# Altium schematic sheet STM32F429.SchDoc
size A3
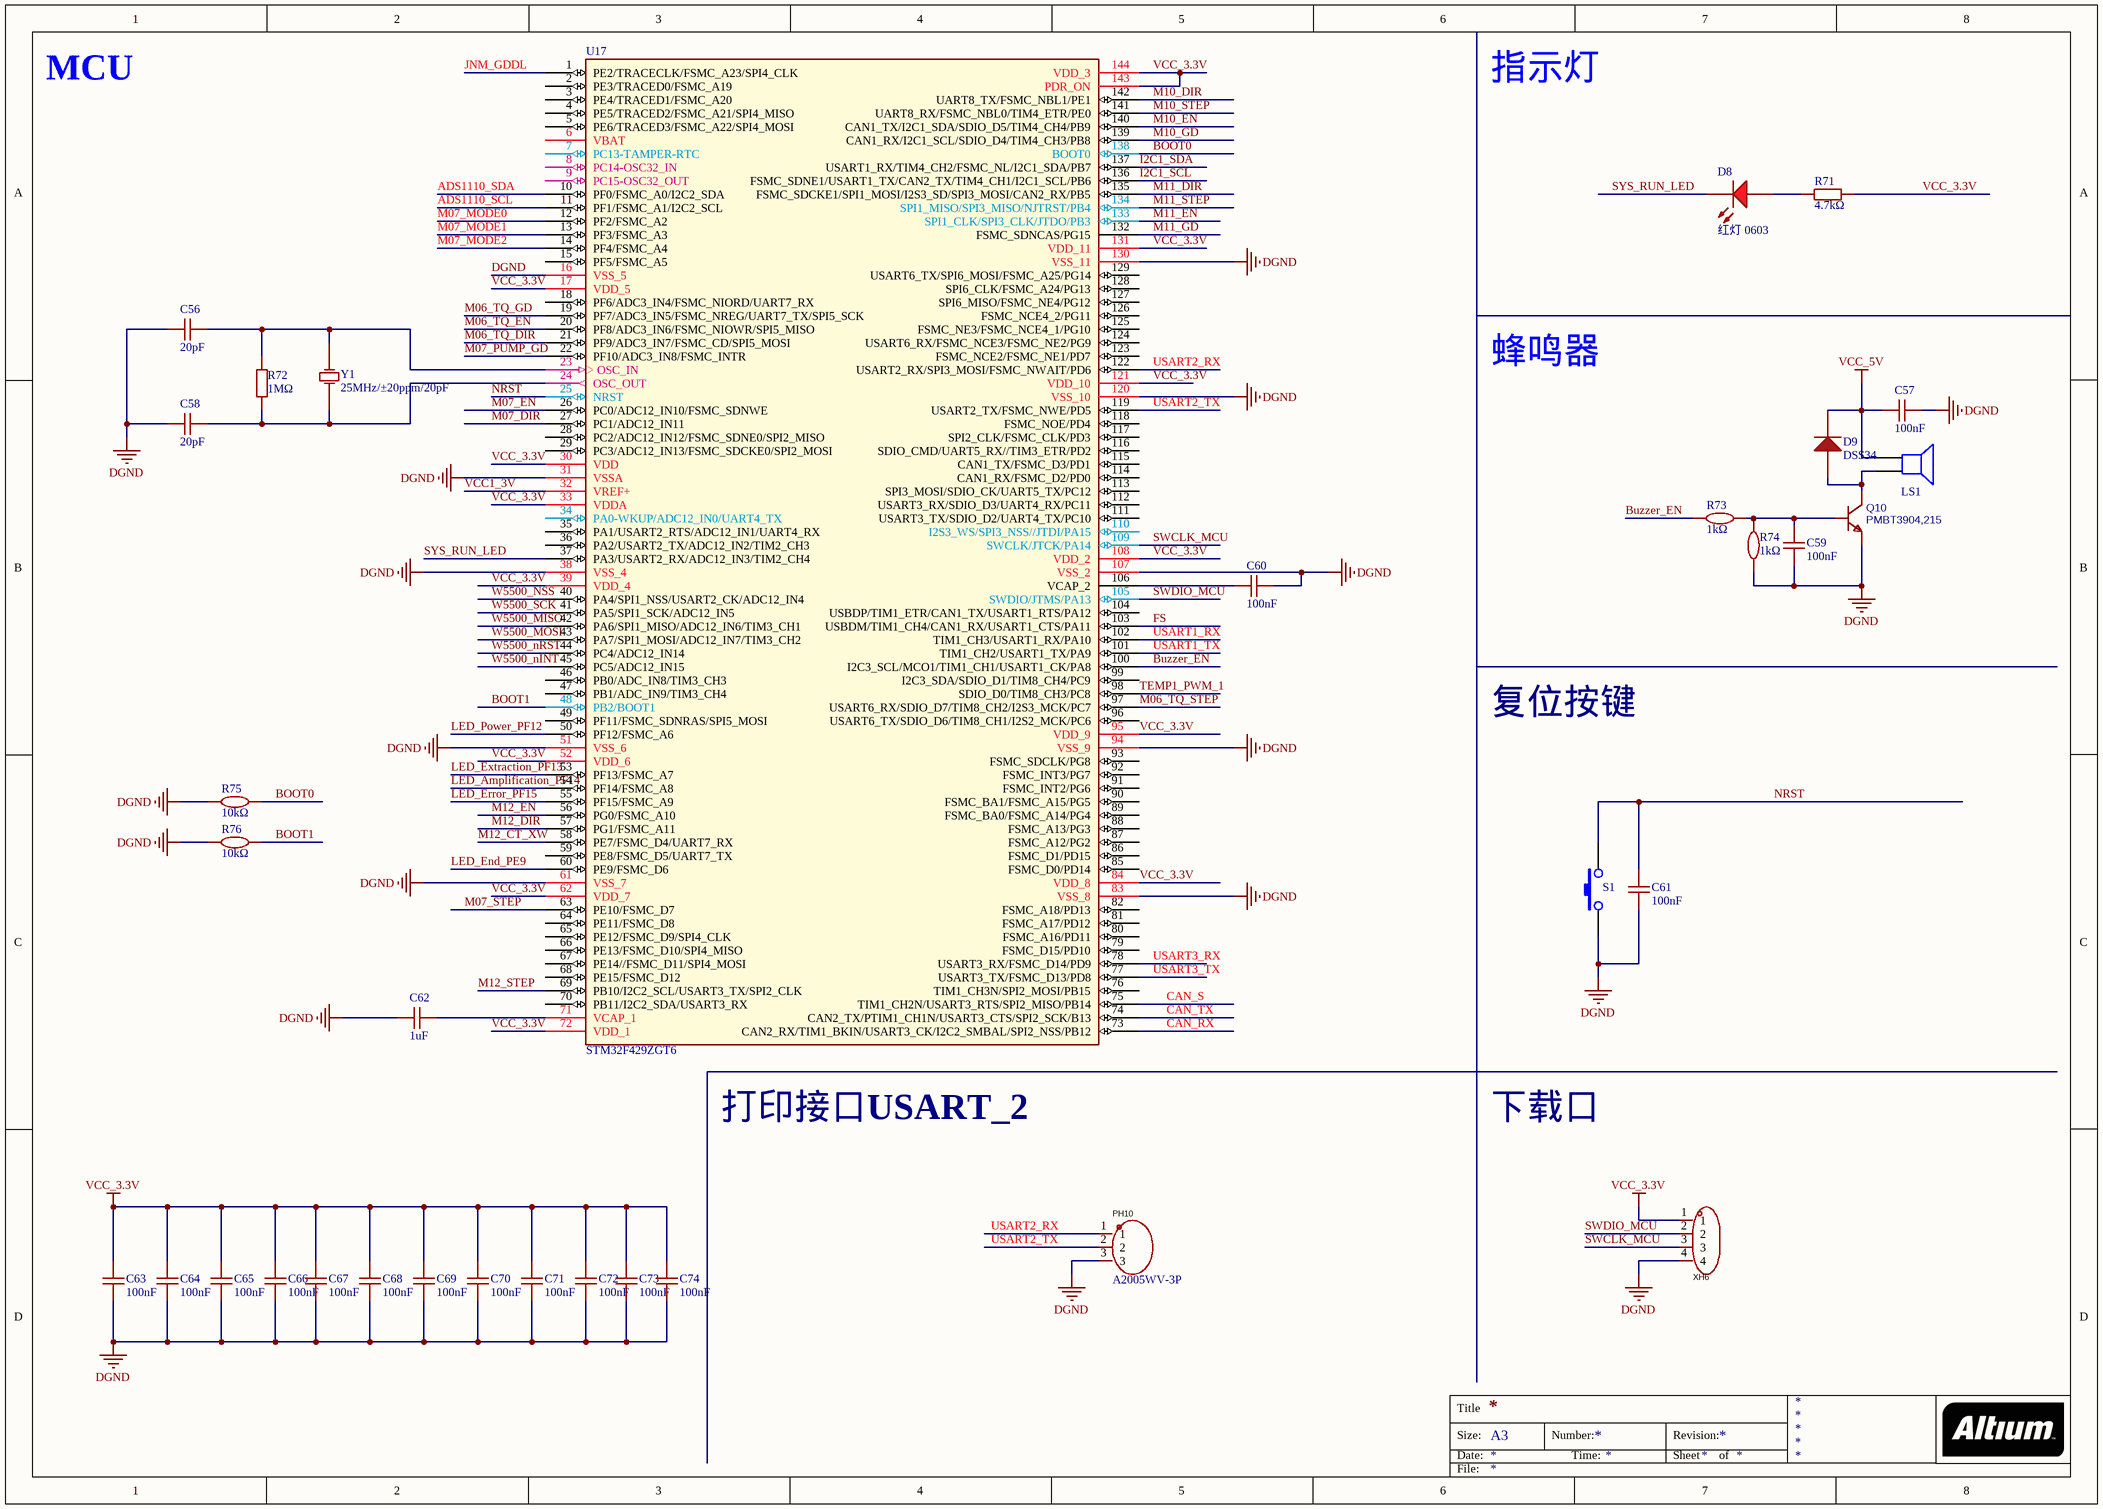
[diagram p0: STM32F429.SchDoc]

## Parts
C56  20pF  [C0603]
C57  100nF  [C0603]
C58  20pF  [C0603]
C59  100nF  [C0603]
C60  100nF  [C0402]
C61  100nF  [C0402]
C62  1uF  [C0402]
C63  100nF  [C0402]
C64  100nF  [C0402]
C65  100nF  [C0402]
C66  100nF  [C0402]
C67  100nF  [C0402]
C68  100nF  [C0402]
C69  100nF  [C0402]
C70  100nF  [C0402]
C71  100nF  [C0402]
C72  100nF  [C0402]
C73  100nF  [C0402]
C74  100nF  [C0402]
D8  红灯 0603  [LED_0603]
D9  DSS34  [SOD-123]
LS1  (no value)  [BUZZER]
PH10  A2005WV-3P  [HDR-TH_3P-P2.00-V-M]
Q10  PMBT3904,215  [SOT-23(SOT-23-3)]
R71  4.7kΩ  [R0603]
R72  1MΩ  [R0603]
R73  1kΩ  [R0603]
R74  1kΩ  [R0603]
R75  10kΩ  [R0402]
R76  10kΩ  [R0402]
S1  (no value)  [SW-S2 贴片]
U17  STM32F429ZGT6  [LQFP-144_20x20x05P]
XH6  A2541WV-4P  [HDR-TH_4P-P2.54-V-M]  (value not drawn)
Y1  25MHz/±20ppm/20pF  [SMD-5032_2P]

## Nets
DGND: C56.1 C57.2 C58.1 C59.1 C60.2 C61.1 C62.1 C63.1 C64.1 C65.1 C66.1 C67.1 C68.1 C69.1 C70.1 C71.1 C72.1 C73.1 C74.1 PH10.3 Q10.2 R74.2 R75.2 R76.2 S1.1 U17.16(VSS_5) U17.31(VSSA) U17.38(VSS_4) U17.51(VSS_6) U17.61(VSS_7) U17.83(VSS_8) U17.94(VSS_9) U17.107(VSS_2) U17.120(VSS_10) U17.130(VSS_11) XH6.4
VCC_3.3V: C63.2 C64.2 C65.2 C66.2 C67.2 C68.2 C69.2 C70.2 C71.2 C72.2 C73.2 C74.2 R71.2 U17.17(VDD_5) U17.30(VDD) U17.33(VDDA) U17.39(VDD_4) U17.52(VDD_6) U17.62(VDD_7) U17.72(VDD_1) U17.84(VDD_8) U17.95(VDD_9) U17.108(VDD_2) U17.121(VDD_10) U17.131(VDD_11) U17.143(PDR_ON) U17.144(VDD_3) XH6.1
VCC_5V: C57.1 D9.2(K) LS1.1
ADS1110_SCL: U17.11(PF1/FSMC_A1/I2C2_SCL)
ADS1110_SDA: U17.10(PF0/FSMC_A0/I2C2_SDA)
BOOT0: R75.1 U17.138(BOOT0)
BOOT1: R76.1 U17.48(PB2/BOOT1)
Buzzer_EN: R73.2 U17.100(I2C3_SCL/MCO1/TIM1_CH1/USART1_CK/PA8)
CAN_RX: U17.73(CAN2_RX/TIM1_BKIN/USART3_CK/I2C2_SMBAL/SPI2_NSS/PB12)
CAN_S: U17.75(TIM1_CH2N/USART3_RTS/SPI2_MISO/PB14)
CAN_TX: U17.74(CAN2_TX/PTIM1_CH1N/USART3_CTS/SPI2_SCK/B13)
FS: U17.103(USBDM/TIM1_CH4/CAN1_RX/USART1_CTS/PA11)
I2C1_SCL: U17.136(FSMC_SDNE1/USART1_TX/CAN2_TX/TIM4_CH1/I2C1_SCL/PB6)
I2C1_SDA: U17.137(USART1_RX/TIM4_CH2/FSMC_NL/I2C1_SDA/PB7)
JNM_GDDL: U17.1(PE2/TRACECLK/FSMC_A23/SPI4_CLK)
LED_Amplification_PF14: U17.54(PF14/FSMC_A8)
LED_End_PE9: U17.60(PE9/FSMC_D6)
LED_Error_PF15: U17.55(PF15/FSMC_A9)
LED_Extraction_PF13: U17.53(PF13/FSMC_A7)
LED_Power_PF12: U17.50(PF12/FSMC_A6)
M06_TQ_DIR: U17.21(PF9/ADC3_IN7/FSMC_CD/SPI5_MOSI)
M06_TQ_EN: U17.20(PF8/ADC3_IN6/FSMC_NIOWR/SPI5_MISO)
M06_TQ_GD: U17.19(PF7/ADC3_IN5/FSMC_NREG/UART7_TX/SPI5_SCK)
M06_TQ_STEP: U17.97(USART6_RX/SDIO_D7/TIM8_CH2/I2S3_MCK/PC7)
M07_DIR: U17.27(PC1/ADC12_IN11)
M07_EN: U17.26(PC0/ADC12_IN10/FSMC_SDNWE)
M07_MODE0: U17.12(PF2/FSMC_A2)
M07_MODE1: U17.13(PF3/FSMC_A3)
M07_MODE2: U17.14(PF4/FSMC_A4)
M07_PUMP_GD: U17.22(PF10/ADC3_IN8/FSMC_INTR)
M07_STEP: U17.63(PE10/FSMC_D7)
M10_DIR: U17.142(UART8_TX/FSMC_NBL1/PE1)
M10_EN: U17.140(CAN1_TX/I2C1_SDA/SDIO_D5/TIM4_CH4/PB9)
M10_GD: U17.139(CAN1_RX/I2C1_SCL/SDIO_D4/TIM4_CH3/PB8)
M10_STEP: U17.141(UART8_RX/FSMC_NBL0/TIM4_ETR/PE0)
M11_DIR: U17.135(FSMC_SDCKE1/SPI1_MOSI/I2S3_SD/SPI3_MOSI/CAN2_RX/PB5)
M11_EN: U17.133(SPI1_CLK/SPI3_CLK/JTDO/PB3)
M11_GD: U17.132(FSMC_SDNCAS/PG15)
M11_STEP: U17.134(SPI1_MISO/SPI3_MISO/NJTRST/PB4)
M12_CT_XW: U17.58(PE7/FSMC_D4/UART7_RX)
M12_DIR: U17.57(PG1/FSMC_A11)
M12_EN: U17.56(PG0/FSMC_A10)
M12_STEP: U17.69(PB10/I2C2_SCL/USART3_TX/SPI2_CLK)
NRST: C61.2 S1.2 U17.25(NRST)
SWCLK_MCU: U17.109(SWCLK/JTCK/PA14) XH6.3
SWDIO_MCU: U17.105(SWDIO/JTMS/PA13) XH6.2
SYS_RUN_LED: D8.K U17.37(PA3/USART2_RX/ADC12_IN3/TIM2_CH4)
TEMP1_PWM_1: U17.98(SDIO_D0/TIM8_CH3/PC8)
USART1_RX: U17.102(TIM1_CH3/USART1_RX/PA10)
USART1_TX: U17.101(TIM1_CH2/USART1_TX/PA9)
USART2_RX: PH10.1 U17.122(USART2_RX/SPI3_MOSI/FSMC_NWAIT/PD6)
USART2_TX: PH10.2 U17.119(USART2_TX/FSMC_NWE/PD5)
USART3_RX: U17.78(USART3_RX/FSMC_D14/PD9)
USART3_TX: U17.77(USART3_TX/FSMC_D13/PD8)
VCC1_3V: U17.32(VREF+)
W5500_MISO: U17.42(PA6/SPI1_MISO/ADC12_IN6/TIM3_CH1)
W5500_MOSI: U17.43(PA7/SPI1_MOSI/ADC12_IN7/TIM3_CH2)
W5500_nINT: U17.45(PC5/ADC12_IN15)
W5500_nRST: U17.44(PC4/ADC12_IN14)
W5500_NSS: U17.40(PA4/SPI1_NSS/USART2_CK/ADC12_IN4)
W5500_SCK: U17.41(PA5/SPI1_SCK/ADC12_IN5)
NetC56_2: C56.2 R72.2 U17.23(OSC_IN) Y1.2(OSC2)
NetC58_2: C58.2 R72.1 U17.24(OSC_OUT) Y1.1(OSC1)
NetC59_2: C59.2 Q10.1 R73.1 R74.1
NetC60_1: C60.1 U17.106(VCAP_2)
NetC62_2: C62.2 U17.71(VCAP_1)
NetD8_A: D8.A R71.1
NetD9_1: D9.1(A) LS1.2 Q10.3

Not connected (* = marked no-connect by the designer): U17 2(PE3/TRACED0/FSMC_A19) 3(PE4/TRACED1/FSMC_A20) 4(PE5/TRACED2/FSMC_A21/SPI4_MISO) 5(PE6/TRACED3/FSMC_A22/SPI4_MOSI) 6(VBAT) 7(PC13-TAMPER-RTC) 8(PC14-OSC32_IN) 9(PC15-OSC32_OUT) 15(PF5/FSMC_A5) 18(PF6/ADC3_IN4/FSMC_NIORD/UART7_RX) 28(PC2/ADC12_IN12/FSMC_SDNE0/SPI2_MISO) 29(PC3/ADC12_IN13/FSMC_SDCKE0/SPI2_MOSI) 34(PA0-WKUP/ADC12_IN0/UART4_TX) 35(PA1/USART2_RTS/ADC12_IN1/UART4_RX) 36(PA2/USART2_TX/ADC12_IN2/TIM2_CH3) 46(PB0/ADC_IN8/TIM3_CH3) 47(PB1/ADC_IN9/TIM3_CH4) 49(PF11/FSMC_SDNRAS/SPI5_MOSI) 59(PE8/FSMC_D5/UART7_TX) 64(PE11/FSMC_D8) 65(PE12/FSMC_D9/SPI4_CLK) 66(PE13/FSMC_D10/SPI4_MISO) 67(PE14//FSMC_D11/SPI4_MOSI) 68(PE15/FSMC_D12) 70(PB11/I2C2_SDA/USART3_RX) 76(TIM1_CH3N/SPI2_MOSI/PB15) 79(FSMC_D15/PD10) 80(FSMC_A16/PD11) 81(FSMC_A17/PD12) 82(FSMC_A18/PD13) 85(FSMC_D0/PD14) 86(FSMC_D1/PD15) 87(FSMC_A12/PG2) 88(FSMC_A13/PG3) 89(FSMC_BA0/FSMC_A14/PG4) 90(FSMC_BA1/FSMC_A15/PG5) 91(FSMC_INT2/PG6) 92(FSMC_INT3/PG7) 93(FSMC_SDCLK/PG8) 96(USART6_TX/SDIO_D6/TIM8_CH1/I2S2_MCK/PC6) 99(I2C3_SDA/SDIO_D1/TIM8_CH4/PC9) 104(USBDP/TIM1_ETR/CAN1_TX/USART1_RTS/PA12) 110(I2S3_WS/SPI3_NSS//JTDI/PA15) 111(USART3_TX/SDIO_D2/UART4_TX/PC10) 112(USART3_RX/SDIO_D3/UART4_RX/PC11) 113(SPI3_MOSI/SDIO_CK/UART5_TX/PC12) 114(CAN1_RX/FSMC_D2/PD0) 115(CAN1_TX/FSMC_D3/PD1) 116(SDIO_CMD/UART5_RX//TIM3_ETR/PD2) 117(SPI2_CLK/FSMC_CLK/PD3) 118(FSMC_NOE/PD4) 123(FSMC_NCE2/FSMC_NE1/PD7) 124(USART6_RX/FSMC_NCE3/FSMC_NE2/PG9) 125(FSMC_NE3/FSMC_NCE4_1/PG10) 126(FSMC_NCE4_2/PG11) 127(SPI6_MISO/FSMC_NE4/PG12) 128(SPI6_CLK/FSMC_A24/PG13) 129(USART6_TX/SPI6_MOSI/FSMC_A25/PG14)

## Notes on the sheet
- MCU
- 指示灯
- 蜂鸣器
- 复位按键
- 打印接口USART_2
- 下载口
- Title
- Size:
- Date:
- A3
- Number:
- Time:
- Revision:
- Sheet
- of
- File:

## Library data of the parts
C56 C58 = 20pF/50V,C0603: 贴片电容,X7R; ComponentLink1Description: 供应商链接; ComponentLink1URL: http://www.szlcsc.com/product/details_16531.html
C57 C59 = 100nF/50V,C0603: 贴片电容,X7R; ComponentLink1Description: 供应商链接; ComponentLink1URL: http://www.szlcsc.com/product/details_16531.html
C60 C61 C63-C74 = 100nF/50V,C0402: 贴片电容,X7R; ComponentLink1Description: 供应商链接; ComponentLink1URL: http://www.szlcsc.com/product/details_16531.html
C62 = 1uF/50V,C0402: 贴片电容,X7R; ComponentLink1Description: 供应商链接; ComponentLink1URL: http://www.szlcsc.com/product/details_16531.html
D8 = 红灯 0603: 发光二极管; ComponentLink1Description: 供应商链接; ComponentLink1URL: http://www.szlcsc.com/product/details_2659.html
D9 = DSS34,SOD-123: 肖特基二极管; ComponentLink1Description: 供应商链接; ComponentLink1URL: http://www.szlcsc.com/product/details_9093.html
LS1 = Speaker: Loudspeaker; Published: 24-Mar-1999; LatestRevisionDate: 17-Jul-2002; LatestRevisionNote: Re-released for DXP Platform.; PackageReference: PIN2; Publisher: Altium Limited
R71 = 4.7kΩ,R0603: 贴片电阻; ComponentLink1Description: 供应商链接; ComponentLink1URL: http://www.szlcsc.com/product/details_21904.html
R72 = 1MΩ,R0603: 贴片电阻; ComponentLink1Description: 供应商链接; ComponentLink1URL: http://www.szlcsc.com/product/details_23662.html
R73 R74 = 1kΩ,R0603: 电阻类型:厚膜电阻;阻值:1kΩ;精度:±1%;功率:125mW;最大工作电压:150V;温度系数:±100ppm/℃;
R75 R76 = 10kΩ,R0402: 电阻类型:厚膜电阻;阻值:10kΩ;精度:±1%;功率:100mW;最大工作电压:75V;温度系数:±100ppm/℃;
S1 = SW-PB
U17 = STM32F429ZGT6: ARM; ComponentLink1Description: 供应商链接; ComponentLink1URL: http://www.szlcsc.com/product/details_47529.html
XH6 = A2541WV-4P: C5346656
Y1 = 25MHz/±20ppm/20pF,SMD5032: X503225MSB2GI;无源晶振; ComponentLink1Description: 供应商链接; ComponentLink1URL: http://www.szlcsc.com/product/details_117214.html